# Altium schematic sheet Private_CPU_DDR4.SchDoc
size D
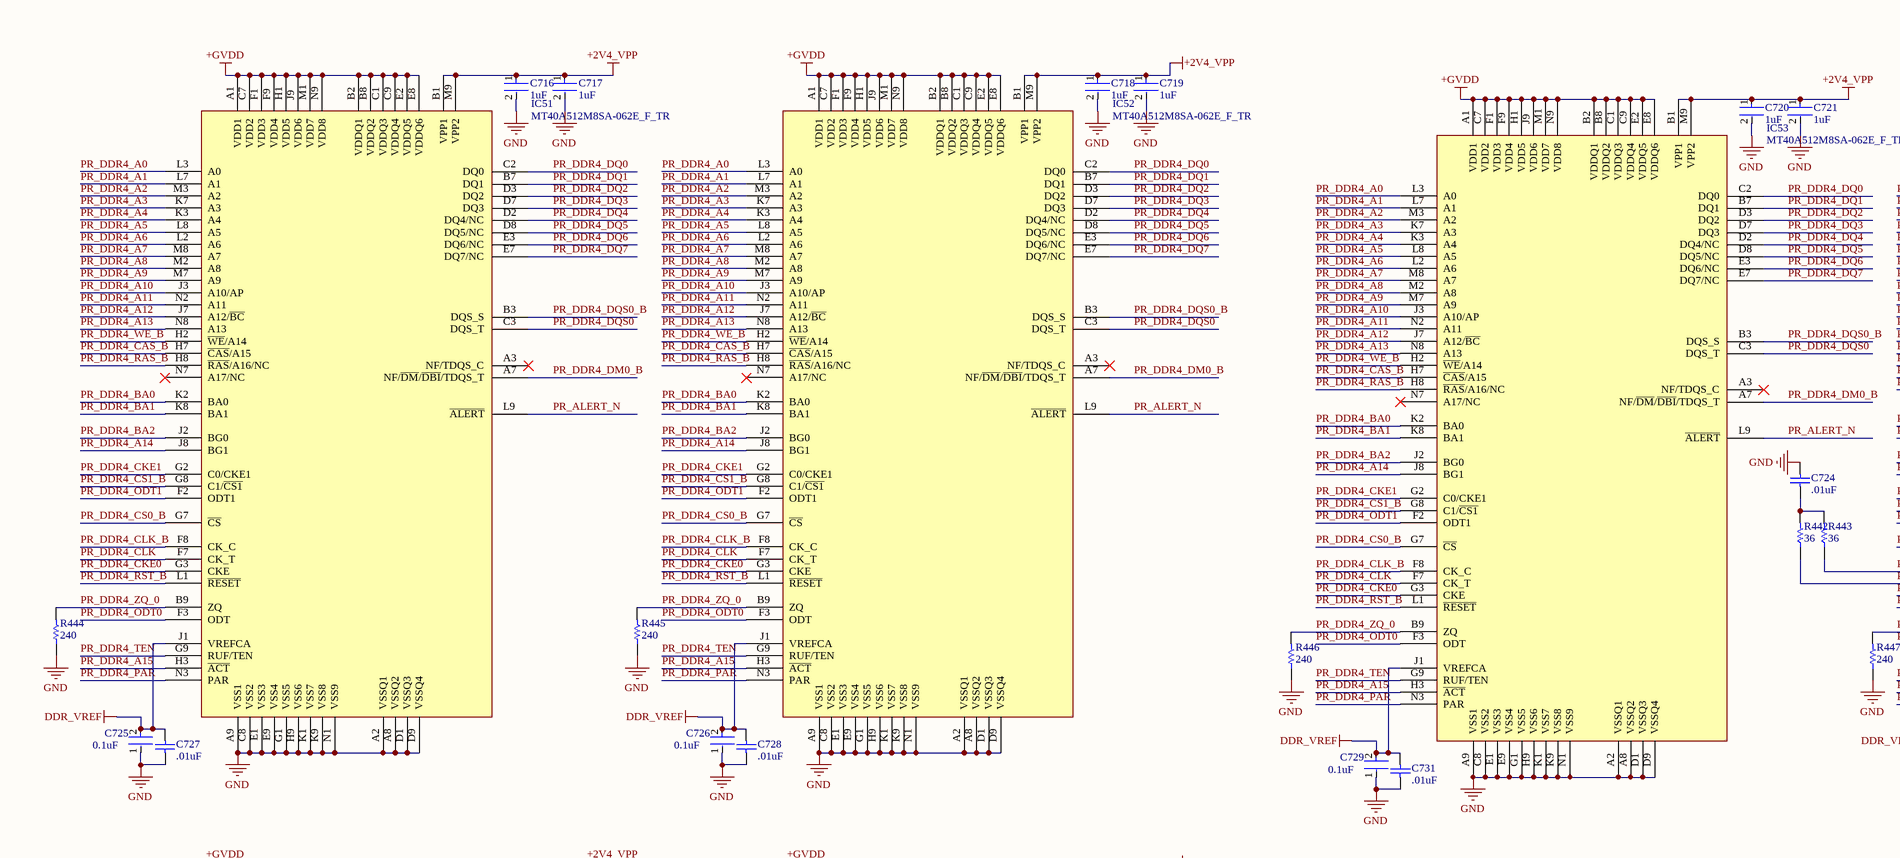
[diagram p0: Private_CPU_DDR4.SchDoc, top left]
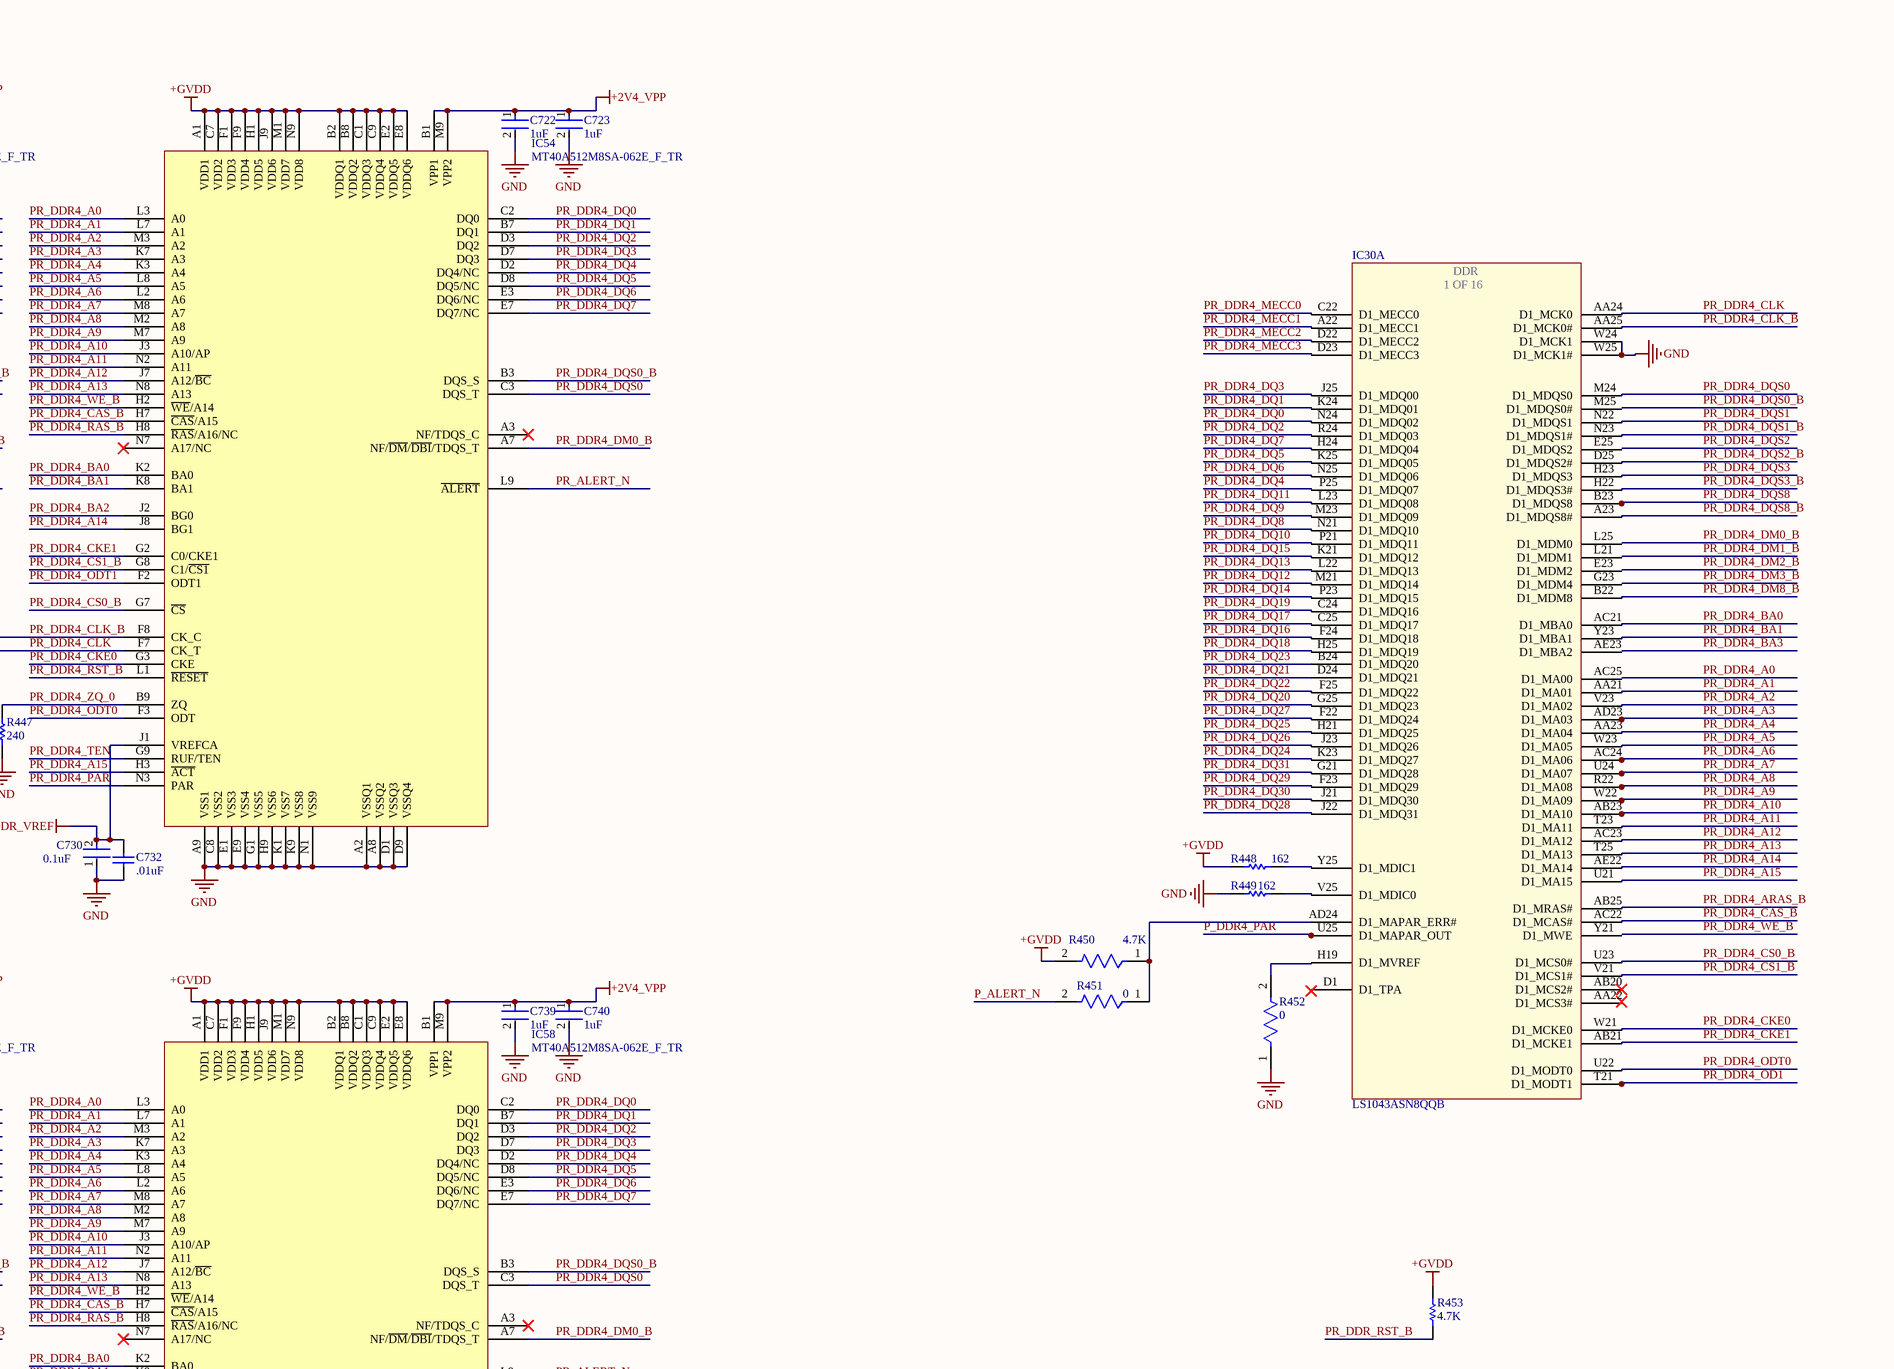
[diagram p1: Private_CPU_DDR4.SchDoc, top right]
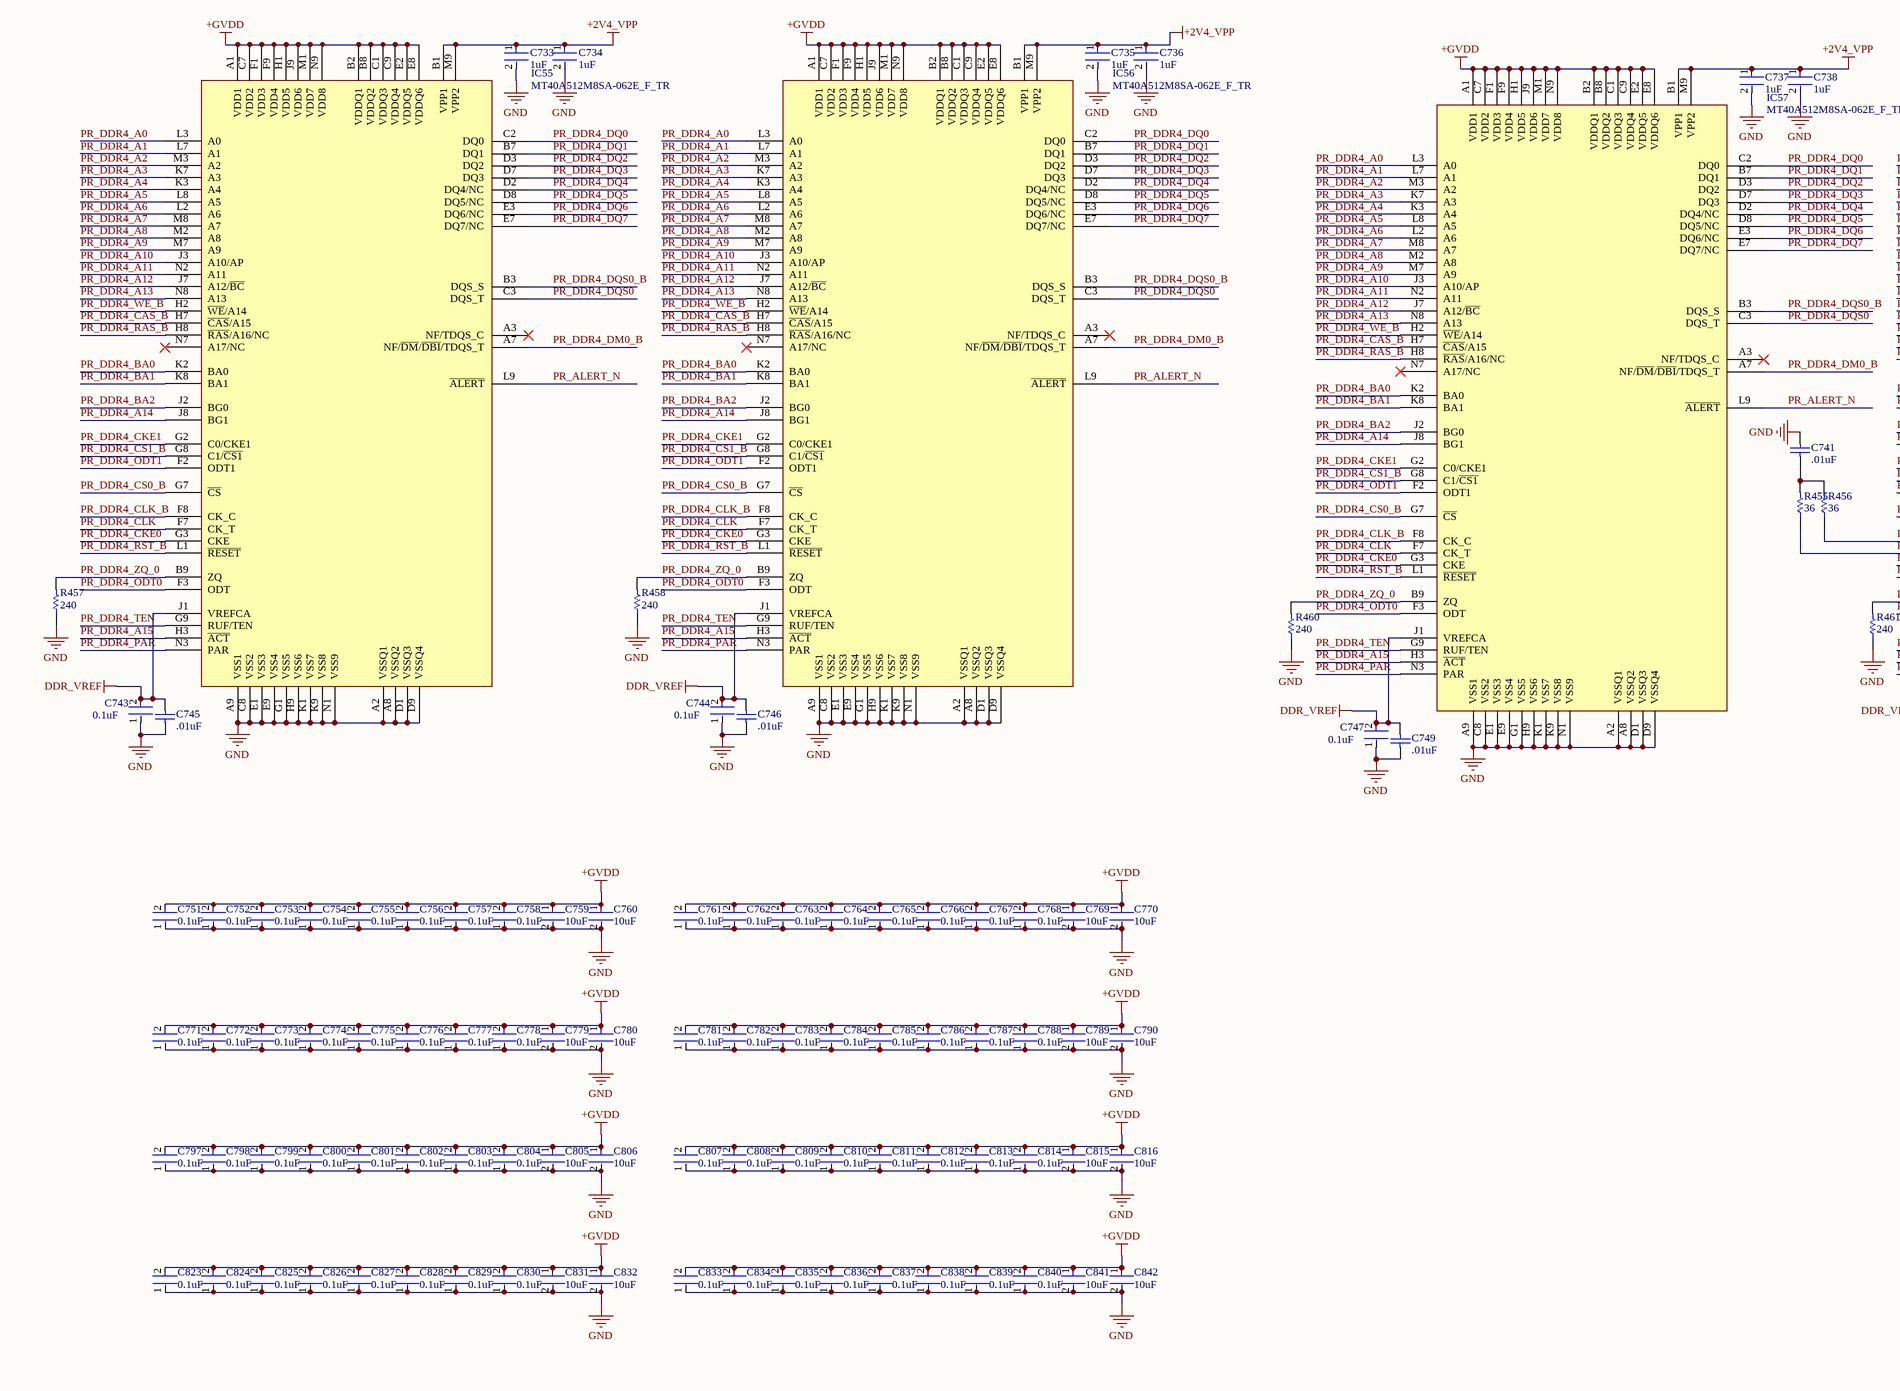
[diagram p2: Private_CPU_DDR4.SchDoc, bottom left]
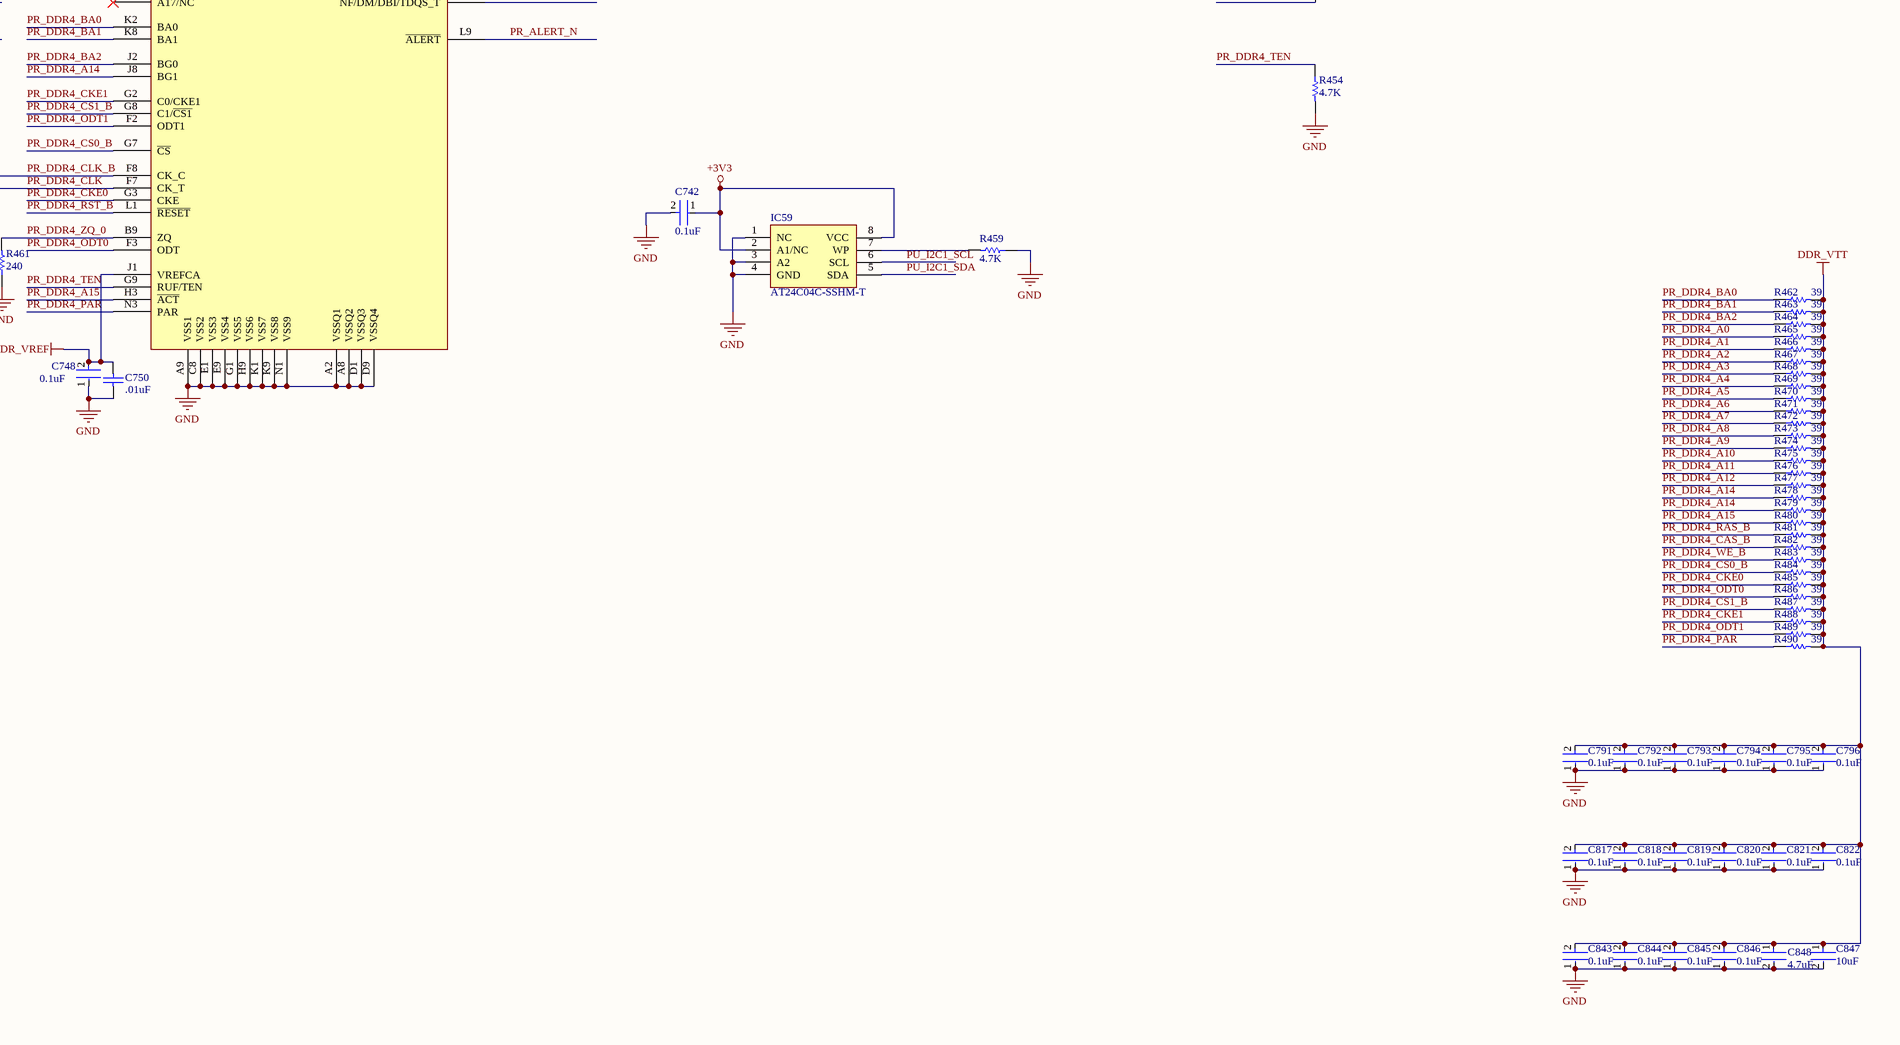
[diagram p3: Private_CPU_DDR4.SchDoc, bottom right]

## Parts
C716  1uF  [FP-GRM15-0_1-MFG]
C717  1uF  [FP-GRM15-0_1-MFG]
C718  1uF  [FP-GRM15-0_1-MFG]
C719  1uF  [FP-GRM15-0_1-MFG]
C720  1uF  [FP-GRM15-0_1-MFG]
C721  1uF  [FP-GRM15-0_1-MFG]
C722  1uF  [FP-GRM15-0_1-MFG]
C723  1uF  [FP-GRM15-0_1-MFG]
C724  .01uF  [CAPC1005X56X25LL10T15]
C725  0.1uF  [FP-GRM15-MFG]
C726  0.1uF  [FP-GRM15-MFG]
C727  .01uF  [CAPC1005X56X25LL10T15]
C728  .01uF  [CAPC1005X56X25LL10T15]
C729  0.1uF  [FP-GRM15-MFG]
C730  0.1uF  [FP-GRM15-MFG]
C731  .01uF  [CAPC1005X56X25LL10T15]
C732  .01uF  [CAPC1005X56X25LL10T15]
C733  1uF  [FP-GRM15-0_1-MFG]
C734  1uF  [FP-GRM15-0_1-MFG]
C735  1uF  [FP-GRM15-0_1-MFG]
C736  1uF  [FP-GRM15-0_1-MFG]
C737  1uF  [FP-GRM15-0_1-MFG]
C738  1uF  [FP-GRM15-0_1-MFG]
C739  1uF  [FP-GRM15-0_1-MFG]
C740  1uF  [FP-GRM15-0_1-MFG]
C741  .01uF  [CAPC1005X56X25LL10T15]
C742  0.1uF  [FP-GRM15-MFG]
C743  0.1uF  [FP-GRM15-MFG]
C744  0.1uF  [FP-GRM15-MFG]
C745  .01uF  [CAPC1005X56X25LL10T15]
C746  .01uF  [CAPC1005X56X25LL10T15]
C747  0.1uF  [FP-GRM15-MFG]
C748  0.1uF  [FP-GRM15-MFG]
C749  .01uF  [CAPC1005X56X25LL10T15]
C750  .01uF  [CAPC1005X56X25LL10T15]
C751  0.1uF  [FP-GRM15-MFG]
C752  0.1uF  [FP-GRM15-MFG]
C753  0.1uF  [FP-GRM15-MFG]
C754  0.1uF  [FP-GRM15-MFG]
C755  0.1uF  [FP-GRM15-MFG]
C756  0.1uF  [FP-GRM15-MFG]
C757  0.1uF  [FP-GRM15-MFG]
C758  0.1uF  [FP-GRM15-MFG]
C759  10uF  [FP-GRM21B-0_1-IPC_C]
C760  10uF  [FP-GRM21B-0_1-IPC_C]
C761  0.1uF  [FP-GRM15-MFG]
C762  0.1uF  [FP-GRM15-MFG]
C763  0.1uF  [FP-GRM15-MFG]
C764  0.1uF  [FP-GRM15-MFG]
C765  0.1uF  [FP-GRM15-MFG]
C766  0.1uF  [FP-GRM15-MFG]
C767  0.1uF  [FP-GRM15-MFG]
C768  0.1uF  [FP-GRM15-MFG]
C769  10uF  [FP-GRM21B-0_1-IPC_C]
C770  10uF  [FP-GRM21B-0_1-IPC_C]
C771  0.1uF  [FP-GRM15-MFG]
C772  0.1uF  [FP-GRM15-MFG]
C773  0.1uF  [FP-GRM15-MFG]
C774  0.1uF  [FP-GRM15-MFG]
C775  0.1uF  [FP-GRM15-MFG]
C776  0.1uF  [FP-GRM15-MFG]
C777  0.1uF  [FP-GRM15-MFG]
C778  0.1uF  [FP-GRM15-MFG]
C779  10uF  [FP-GRM21B-0_1-IPC_C]
C780  10uF  [FP-GRM21B-0_1-IPC_C]
C781  0.1uF  [FP-GRM15-MFG]
C782  0.1uF  [FP-GRM15-MFG]
C783  0.1uF  [FP-GRM15-MFG]
C784  0.1uF  [FP-GRM15-MFG]
C785  0.1uF  [FP-GRM15-MFG]
C786  0.1uF  [FP-GRM15-MFG]
C787  0.1uF  [FP-GRM15-MFG]
C788  0.1uF  [FP-GRM15-MFG]
C789  10uF  [FP-GRM21B-0_1-IPC_C]
C790  10uF  [FP-GRM21B-0_1-IPC_C]
C791  0.1uF  [FP-GRM15-MFG]
C792  0.1uF  [FP-GRM15-MFG]
C793  0.1uF  [FP-GRM15-MFG]
C794  0.1uF  [FP-GRM15-MFG]
C795  0.1uF  [FP-GRM15-MFG]
C796  0.1uF  [FP-GRM15-MFG]
C797  0.1uF  [FP-GRM15-MFG]
C798  0.1uF  [FP-GRM15-MFG]
C799  0.1uF  [FP-GRM15-MFG]
C800  0.1uF  [FP-GRM15-MFG]
C801  0.1uF  [FP-GRM15-MFG]
C802  0.1uF  [FP-GRM15-MFG]
C803  0.1uF  [FP-GRM15-MFG]
C804  0.1uF  [FP-GRM15-MFG]
C805  10uF  [FP-GRM21B-0_1-IPC_C]
C806  10uF  [FP-GRM21B-0_1-IPC_C]
C807  0.1uF  [FP-GRM15-MFG]
C808  0.1uF  [FP-GRM15-MFG]
C809  0.1uF  [FP-GRM15-MFG]
C810  0.1uF  [FP-GRM15-MFG]
C811  0.1uF  [FP-GRM15-MFG]
C812  0.1uF  [FP-GRM15-MFG]
C813  0.1uF  [FP-GRM15-MFG]
C814  0.1uF  [FP-GRM15-MFG]
C815  10uF  [FP-GRM21B-0_1-IPC_C]
C816  10uF  [FP-GRM21B-0_1-IPC_C]
C817  0.1uF  [FP-GRM15-MFG]
C818  0.1uF  [FP-GRM15-MFG]
C819  0.1uF  [FP-GRM15-MFG]
C820  0.1uF  [FP-GRM15-MFG]
C821  0.1uF  [FP-GRM15-MFG]
C822  0.1uF  [FP-GRM15-MFG]
C823  0.1uF  [FP-GRM15-MFG]
C824  0.1uF  [FP-GRM15-MFG]
C825  0.1uF  [FP-GRM15-MFG]
C826  0.1uF  [FP-GRM15-MFG]
C827  0.1uF  [FP-GRM15-MFG]
C828  0.1uF  [FP-GRM15-MFG]
C829  0.1uF  [FP-GRM15-MFG]
C830  0.1uF  [FP-GRM15-MFG]
C831  10uF  [FP-GRM21B-0_1-IPC_C]
C832  10uF  [FP-GRM21B-0_1-IPC_C]
C833  0.1uF  [FP-GRM15-MFG]
C834  0.1uF  [FP-GRM15-MFG]
C835  0.1uF  [FP-GRM15-MFG]
C836  0.1uF  [FP-GRM15-MFG]
C837  0.1uF  [FP-GRM15-MFG]
C838  0.1uF  [FP-GRM15-MFG]
C839  0.1uF  [FP-GRM15-MFG]
C840  0.1uF  [FP-GRM15-MFG]
C841  10uF  [FP-GRM21B-0_1-IPC_C]
C842  10uF  [FP-GRM21B-0_1-IPC_C]
C843  0.1uF  [FP-GRM15-MFG]
C844  0.1uF  [FP-GRM15-MFG]
C845  0.1uF  [FP-GRM15-MFG]
C846  0.1uF  [FP-GRM15-MFG]
C847  10uF  [FP-GRM21B-0_1-IPC_C]
C848  4.7uF  [FP-GRM155-0_1-IPC_B]
IC30  LS1043ASN8QQB  [BGA780C80P28X28_2300X2300X261]  (part A of 16)
IC51  MT40A512M8SA-062E_F_TR  [BGA78C80P9X13_750X1100X120]
IC52  MT40A512M8SA-062E_F_TR  [BGA78C80P9X13_750X1100X120]
IC53  MT40A512M8SA-062E_F_TR  [BGA78C80P9X13_750X1100X120]
IC54  MT40A512M8SA-062E_F_TR  [BGA78C80P9X13_750X1100X120]
IC55  MT40A512M8SA-062E_F_TR  [BGA78C80P9X13_750X1100X120]
IC56  MT40A512M8SA-062E_F_TR  [BGA78C80P9X13_750X1100X120]
IC57  MT40A512M8SA-062E_F_TR  [BGA78C80P9X13_750X1100X120]
IC58  MT40A512M8SA-062E_F_TR  [BGA78C80P9X13_750X1100X120]
IC59  AT24C04C-SSHM-T  [SOIC127P600X175-8N]
R442  36  [RESC1005X40X25ML05T05]
R443  36  [RESC1005X40X25ML05T05]
R444  240  [RESC1005X40X25ML05T05]
R445  240  [RESC1005X40X25ML05T05]
R446  240  [RESC1005X40X25ML05T05]
R447  240  [RESC1005X40X25ML05T05]
R448  162  [RESC1005X40X25LL05T05]
R449  162  [RESC1005X40X25LL05T05]
R450  4.7K  [FP-CRCW0402-e3-IPC_B]
R451  0  [FP-CRCW0402-e3-IPC_C]
R452  0  [FP-CRCW0402-e3-IPC_C]
R453  4.7K  [RESC1005X40X25LL05T05]
R454  4.7K  [RESC1005X40X25LL05T05]
R455  36  [RESC1005X40X25ML05T05]
R456  36  [RESC1005X40X25ML05T05]
R457  240  [RESC1005X40X25ML05T05]
R458  240  [RESC1005X40X25ML05T05]
R459  4.7K  [RESC1005X40X25LL05T05]
R460  240  [RESC1005X40X25ML05T05]
R461  240  [RESC1005X40X25ML05T05]
R462  39  [RESC1005X40X25LL05T05]
R463  39  [RESC1005X40X25LL05T05]
R464  39  [RESC1005X40X25LL05T05]
R465  39  [RESC1005X40X25LL05T05]
R466  39  [RESC1005X40X25LL05T05]
R467  39  [RESC1005X40X25LL05T05]
R468  39  [RESC1005X40X25LL05T05]
R469  39  [RESC1005X40X25LL05T05]
R470  39  [RESC1005X40X25LL05T05]
R471  39  [RESC1005X40X25LL05T05]
R472  39  [RESC1005X40X25LL05T05]
R473  39  [RESC1005X40X25LL05T05]
R474  39  [RESC1005X40X25LL05T05]
R475  39  [RESC1005X40X25LL05T05]
R476  39  [RESC1005X40X25LL05T05]
R477  39  [RESC1005X40X25LL05T05]
R478  39  [RESC1005X40X25LL05T05]
R479  39  [RESC1005X40X25LL05T05]
R480  39  [RESC1005X40X25LL05T05]
R481  39  [RESC1005X40X25LL05T05]
R482  39  [RESC1005X40X25LL05T05]
R483  39  [RESC1005X40X25LL05T05]
R484  39  [RESC1005X40X25LL05T05]
R485  39  [RESC1005X40X25LL05T05]
R486  39  [RESC1005X40X25LL05T05]
R487  39  [RESC1005X40X25LL05T05]
R488  39  [RESC1005X40X25LL05T05]
R489  39  [RESC1005X40X25LL05T05]
R490  39  [RESC1005X40X25LL05T05]

## Nets
+2V4_VPP: C716.1 C717.1 C718.1 C719.1 C720.1 C721.1 C722.1 C723.1 C733.1 C734.1 C735.1 C736.1 C737.1 C738.1 C739.1 C740.1 IC51.B1(VPP1) IC51.M9(VPP2) IC52.B1(VPP1) IC52.M9(VPP2) IC53.B1(VPP1) IC53.M9(VPP2) IC54.B1(VPP1) IC54.M9(VPP2) IC55.B1(VPP1) IC55.M9(VPP2) IC56.B1(VPP1) IC56.M9(VPP2) IC57.B1(VPP1) IC57.M9(VPP2) IC58.B1(VPP1) IC58.M9(VPP2)
+3V3: C742.1 IC59.2(A1/NC) IC59.8(VCC)
+GVDD: C751.2 C752.2 C753.2 C754.2 C755.2 C756.2 C757.2 C758.2 C759.1 C760.1 C761.2 C762.2 C763.2 C764.2 C765.2 C766.2 C767.2 C768.2 C769.1 C770.1 C771.2 C772.2 C773.2 C774.2 C775.2 C776.2 C777.2 C778.2 C779.1 C780.1 C781.2 C782.2 C783.2 C784.2 C785.2 C786.2 C787.2 C788.2 C789.1 C790.1 C797.2 C798.2 C799.2 C800.2 C801.2 C802.2 C803.2 C804.2 C805.1 C806.1 C807.2 C808.2 C809.2 C810.2 C811.2 C812.2 C813.2 C814.2 C815.1 C816.1 C823.2 C824.2 C825.2 C826.2 C827.2 C828.2 C829.2 C830.2 C831.1 C832.1 C833.2 C834.2 C835.2 C836.2 C837.2 C838.2 C839.2 C840.2 C841.1 C842.1 IC51.A1(VDD1) IC51.B2(VDDQ1) IC51.B8(VDDQ2) IC51.C1(VDDQ3) IC51.C7(VDD2) IC51.C9(VDDQ4) IC51.E2(VDDQ5) IC51.E8(VDDQ6) IC51.F1(VDD3) IC51.F9(VDD4) IC51.H1(VDD5) IC51.J9(VDD6) IC51.M1(VDD7) IC51.N9(VDD8) IC52.A1(VDD1) IC52.B2(VDDQ1) IC52.B8(VDDQ2) IC52.C1(VDDQ3) IC52.C7(VDD2) IC52.C9(VDDQ4) IC52.E2(VDDQ5) IC52.E8(VDDQ6) IC52.F1(VDD3) IC52.F9(VDD4) IC52.H1(VDD5) IC52.J9(VDD6) IC52.M1(VDD7) IC52.N9(VDD8) IC53.A1(VDD1) IC53.B2(VDDQ1) IC53.B8(VDDQ2) IC53.C1(VDDQ3) IC53.C7(VDD2) IC53.C9(VDDQ4) IC53.E2(VDDQ5) IC53.E8(VDDQ6) IC53.F1(VDD3) IC53.F9(VDD4) IC53.H1(VDD5) IC53.J9(VDD6) IC53.M1(VDD7) IC53.N9(VDD8) IC54.A1(VDD1) IC54.B2(VDDQ1) IC54.B8(VDDQ2) IC54.C1(VDDQ3) IC54.C7(VDD2) IC54.C9(VDDQ4) IC54.E2(VDDQ5) IC54.E8(VDDQ6) IC54.F1(VDD3) IC54.F9(VDD4) IC54.H1(VDD5) IC54.J9(VDD6) IC54.M1(VDD7) IC54.N9(VDD8) IC55.A1(VDD1) IC55.B2(VDDQ1) IC55.B8(VDDQ2) IC55.C1(VDDQ3) IC55.C7(VDD2) IC55.C9(VDDQ4) IC55.E2(VDDQ5) IC55.E8(VDDQ6) IC55.F1(VDD3) IC55.F9(VDD4) IC55.H1(VDD5) IC55.J9(VDD6) IC55.M1(VDD7) IC55.N9(VDD8) IC56.A1(VDD1) IC56.B2(VDDQ1) IC56.B8(VDDQ2) IC56.C1(VDDQ3) IC56.C7(VDD2) IC56.C9(VDDQ4) IC56.E2(VDDQ5) IC56.E8(VDDQ6) IC56.F1(VDD3) IC56.F9(VDD4) IC56.H1(VDD5) IC56.J9(VDD6) IC56.M1(VDD7) IC56.N9(VDD8) IC57.A1(VDD1) IC57.B2(VDDQ1) IC57.B8(VDDQ2) IC57.C1(VDDQ3) IC57.C7(VDD2) IC57.C9(VDDQ4) IC57.E2(VDDQ5) IC57.E8(VDDQ6) IC57.F1(VDD3) IC57.F9(VDD4) IC57.H1(VDD5) IC57.J9(VDD6) IC57.M1(VDD7) IC57.N9(VDD8) IC58.A1(VDD1) IC58.B2(VDDQ1) IC58.B8(VDDQ2) IC58.C1(VDDQ3) IC58.C7(VDD2) IC58.C9(VDDQ4) IC58.E2(VDDQ5) IC58.E8(VDDQ6) IC58.F1(VDD3) IC58.F9(VDD4) IC58.H1(VDD5) IC58.J9(VDD6) IC58.M1(VDD7) IC58.N9(VDD8) R448.1 R450.2 R453.1
DDR_VREF: C725.2 C726.2 C727.2 C728.2 C729.2 C730.2 C731.2 C732.2 C743.2 C744.2 C745.2 C746.2 C747.2 C748.2 C749.2 C750.2 IC51.J1(VREFCA) IC52.J1(VREFCA) IC53.J1(VREFCA) IC54.J1(VREFCA) IC55.J1(VREFCA) IC56.J1(VREFCA) IC57.J1(VREFCA) IC58.J1(VREFCA)
DDR_VTT: C791.2 C792.2 C793.2 C794.2 C795.2 C796.2 C817.2 C818.2 C819.2 C820.2 C821.2 C822.2 C843.2 C844.2 C845.2 C846.2 C847.1 C848.1 R462.2 R463.2 R464.2 R465.2 R466.2 R467.2 R468.2 R469.2 R470.2 R471.2 R472.2 R473.2 R474.2 R475.2 R476.2 R477.2 R478.2 R479.2 R480.2 R481.2 R482.2 R483.2 R484.2 R485.2 R486.2 R487.2 R488.2 R489.2 R490.2
GND: C716.2 C717.2 C718.2 C719.2 C720.2 C721.2 C722.2 C723.2 C724.2 C725.1 C726.1 C727.1 C728.1 C729.1 C730.1 C731.1 C732.1 C733.2 C734.2 C735.2 C736.2 C737.2 C738.2 C739.2 C740.2 C741.2 C742.2 C743.1 C744.1 C745.1 C746.1 C747.1 C748.1 C749.1 C750.1 C751.1 C752.1 C753.1 C754.1 C755.1 C756.1 C757.1 C758.1 C759.2 C760.2 C761.1 C762.1 C763.1 C764.1 C765.1 C766.1 C767.1 C768.1 C769.2 C770.2 C771.1 C772.1 C773.1 C774.1 C775.1 C776.1 C777.1 C778.1 C779.2 C780.2 C781.1 C782.1 C783.1 C784.1 C785.1 C786.1 C787.1 C788.1 C789.2 C790.2 C791.1 C792.1 C793.1 C794.1 C795.1 C796.1 C797.1 C798.1 C799.1 C800.1 C801.1 C802.1 C803.1 C804.1 C805.2 C806.2 C807.1 C808.1 C809.1 C810.1 C811.1 C812.1 C813.1 C814.1 C815.2 C816.2 C817.1 C818.1 C819.1 C820.1 C821.1 C822.1 C823.1 C824.1 C825.1 C826.1 C827.1 C828.1 C829.1 C830.1 C831.2 C832.2 C833.1 C834.1 C835.1 C836.1 C837.1 C838.1 C839.1 C840.1 C841.2 C842.2 C843.1 C844.1 C845.1 C846.1 C847.2 C848.2 IC30.W24(D1_MCK1) IC30.W25(D1_MCK1#) IC51.A2(VSSQ1) IC51.A8(VSSQ2) IC51.A9(VSS1) IC51.C8(VSS2) IC51.D1(VSSQ3) IC51.D9(VSSQ4) IC51.E1(VSS3) IC51.E9(VSS4) IC51.G1(VSS5) IC51.H9(VSS6) IC51.K1(VSS7) IC51.K9(VSS8) IC51.N1(VSS9) IC52.A2(VSSQ1) IC52.A8(VSSQ2) IC52.A9(VSS1) IC52.C8(VSS2) IC52.D1(VSSQ3) IC52.D9(VSSQ4) IC52.E1(VSS3) IC52.E9(VSS4) IC52.G1(VSS5) IC52.H9(VSS6) IC52.K1(VSS7) IC52.K9(VSS8) IC52.N1(VSS9) IC53.A2(VSSQ1) IC53.A8(VSSQ2) IC53.A9(VSS1) IC53.C8(VSS2) IC53.D1(VSSQ3) IC53.D9(VSSQ4) IC53.E1(VSS3) IC53.E9(VSS4) IC53.G1(VSS5) IC53.H9(VSS6) IC53.K1(VSS7) IC53.K9(VSS8) IC53.N1(VSS9) IC54.A2(VSSQ1) IC54.A8(VSSQ2) IC54.A9(VSS1) IC54.C8(VSS2) IC54.D1(VSSQ3) IC54.D9(VSSQ4) IC54.E1(VSS3) IC54.E9(VSS4) IC54.G1(VSS5) IC54.H9(VSS6) IC54.K1(VSS7) IC54.K9(VSS8) IC54.N1(VSS9) IC55.A2(VSSQ1) IC55.A8(VSSQ2) IC55.A9(VSS1) IC55.C8(VSS2) IC55.D1(VSSQ3) IC55.D9(VSSQ4) IC55.E1(VSS3) IC55.E9(VSS4) IC55.G1(VSS5) IC55.H9(VSS6) IC55.K1(VSS7) IC55.K9(VSS8) IC55.N1(VSS9) IC56.A2(VSSQ1) IC56.A8(VSSQ2) IC56.A9(VSS1) IC56.C8(VSS2) IC56.D1(VSSQ3) IC56.D9(VSSQ4) IC56.E1(VSS3) IC56.E9(VSS4) IC56.G1(VSS5) IC56.H9(VSS6) IC56.K1(VSS7) IC56.K9(VSS8) IC56.N1(VSS9) IC57.A2(VSSQ1) IC57.A8(VSSQ2) IC57.A9(VSS1) IC57.C8(VSS2) IC57.D1(VSSQ3) IC57.D9(VSSQ4) IC57.E1(VSS3) IC57.E9(VSS4) IC57.G1(VSS5) IC57.H9(VSS6) IC57.K1(VSS7) IC57.K9(VSS8) IC57.N1(VSS9) IC58.A2(VSSQ1) IC58.A8(VSSQ2) IC58.A9(VSS1) IC58.C8(VSS2) IC58.D1(VSSQ3) IC58.D9(VSSQ4) IC58.E1(VSS3) IC58.E9(VSS4) IC58.G1(VSS5) IC58.H9(VSS6) IC58.K1(VSS7) IC58.K9(VSS8) IC58.N1(VSS9) IC59.1(NC) IC59.3(A2) IC59.4(GND) R444.1 R445.1 R446.1 R447.1 R449.1 R452.1 R454.2 R457.1 R458.1 R459.1 R460.1 R461.1
P_ALERT_N: R451.2
P_DDR4_PAR: IC30.U25(D1_MAPAR_OUT)
PR_ALERT_N: IC51.L9(~{ALERT}) IC52.L9(~{ALERT}) IC53.L9(~{ALERT}) IC54.L9(~{ALERT}) IC55.L9(~{ALERT}) IC56.L9(~{ALERT}) IC57.L9(~{ALERT}) IC58.L9(~{ALERT})
PR_DDR4_A0: IC51.L3(A0) IC52.L3(A0) IC53.L3(A0) IC54.L3(A0) IC55.L3(A0) IC56.L3(A0) IC57.L3(A0) IC58.L3(A0) R465.1
PR_DDR4_A1: IC30.AA21(D1_MA01) IC51.L7(A1) IC52.L7(A1) IC53.L7(A1) IC54.L7(A1) IC55.L7(A1) IC56.L7(A1) IC57.L7(A1) IC58.L7(A1) R466.1
PR_DDR4_A2: IC30.V23(D1_MA02) IC51.M3(A2) IC52.M3(A2) IC53.M3(A2) IC54.M3(A2) IC55.M3(A2) IC56.M3(A2) IC57.M3(A2) IC58.M3(A2) R467.1
PR_DDR4_A3: IC30.AD23(D1_MA03) IC51.K7(A3) IC52.K7(A3) IC53.K7(A3) IC54.K7(A3) IC55.K7(A3) IC56.K7(A3) IC57.K7(A3) IC58.K7(A3) R468.1
PR_DDR4_A4: IC30.AA23(D1_MA04) IC51.K3(A4) IC52.K3(A4) IC53.K3(A4) IC54.K3(A4) IC55.K3(A4) IC56.K3(A4) IC57.K3(A4) IC58.K3(A4) R469.1
PR_DDR4_A5: IC30.W23(D1_MA05) IC51.L8(A5) IC52.L8(A5) IC53.L8(A5) IC54.L8(A5) IC55.L8(A5) IC56.L8(A5) IC57.L8(A5) IC58.L8(A5) R470.1
PR_DDR4_A6: IC30.AC24(D1_MA06) IC51.L2(A6) IC52.L2(A6) IC53.L2(A6) IC54.L2(A6) IC55.L2(A6) IC56.L2(A6) IC57.L2(A6) IC58.L2(A6) R471.1
PR_DDR4_A7: IC30.U24(D1_MA07) IC51.M8(A7) IC52.M8(A7) IC53.M8(A7) IC54.M8(A7) IC55.M8(A7) IC56.M8(A7) IC57.M8(A7) IC58.M8(A7) R472.1
PR_DDR4_A8: IC30.R22(D1_MA08) IC51.M2(A8) IC52.M2(A8) IC53.M2(A8) IC54.M2(A8) IC55.M2(A8) IC56.M2(A8) IC57.M2(A8) IC58.M2(A8) R473.1
PR_DDR4_A9: IC30.W22(D1_MA09) IC51.M7(A9) IC52.M7(A9) IC53.M7(A9) IC54.M7(A9) IC55.M7(A9) IC56.M7(A9) IC57.M7(A9) IC58.M7(A9) R474.1
PR_DDR4_A10: IC30.AB23(D1_MA10) IC51.J3(A10/AP) IC52.J3(A10/AP) IC53.J3(A10/AP) IC54.J3(A10/AP) IC55.J3(A10/AP) IC56.J3(A10/AP) IC57.J3(A10/AP) IC58.J3(A10/AP) R475.1
PR_DDR4_A11: IC30.T23(D1_MA11) IC51.N2(A11) IC52.N2(A11) IC53.N2(A11) IC54.N2(A11) IC55.N2(A11) IC56.N2(A11) IC57.N2(A11) IC58.N2(A11) R476.1
PR_DDR4_A12: IC30.AC23(D1_MA12) IC51.J7(A12/~{BC}) IC52.J7(A12/~{BC}) IC53.J7(A12/~{BC}) IC54.J7(A12/~{BC}) IC55.J7(A12/~{BC}) IC56.J7(A12/~{BC}) IC57.J7(A12/~{BC}) IC58.J7(A12/~{BC}) R477.1
PR_DDR4_A13: IC30.T25(D1_MA13) IC51.N8(A13) IC52.N8(A13) IC53.N8(A13) IC54.N8(A13) IC55.N8(A13) IC56.N8(A13) IC57.N8(A13) IC58.N8(A13)
PR_DDR4_A14: IC30.AE22(D1_MA14) IC51.J8(BG1) IC52.J8(BG1) IC53.J8(BG1) IC54.J8(BG1) IC55.J8(BG1) IC56.J8(BG1) IC57.J8(BG1) IC58.J8(BG1) R478.1 R479.1
PR_DDR4_A15: IC30.U21(D1_MA15) IC51.H3(~{ACT}) IC52.H3(~{ACT}) IC53.H3(~{ACT}) IC54.H3(~{ACT}) IC55.H3(~{ACT}) IC56.H3(~{ACT}) IC57.H3(~{ACT}) IC58.H3(~{ACT}) R480.1
PR_DDR4_ARAS_B: IC30.AB25(D1_MRAS#)
PR_DDR4_BA0: IC30.AC21(D1_MBA0) IC51.K2(BA0) IC52.K2(BA0) IC53.K2(BA0) IC54.K2(BA0) IC55.K2(BA0) IC56.K2(BA0) IC57.K2(BA0) IC58.K2(BA0) R462.1
PR_DDR4_BA1: IC30.Y23(D1_MBA1) IC51.K8(BA1) IC52.K8(BA1) IC53.K8(BA1) IC54.K8(BA1) IC55.K8(BA1) IC56.K8(BA1) IC57.K8(BA1) IC58.K8(BA1) R463.1
PR_DDR4_BA2: IC51.J2(BG0) IC52.J2(BG0) IC53.J2(BG0) IC54.J2(BG0) IC55.J2(BG0) IC56.J2(BG0) IC57.J2(BG0) IC58.J2(BG0) R464.1
PR_DDR4_CAS_B: IC30.AC22(D1_MCAS#) IC51.H7(~{CAS}/A15) IC52.H7(~{CAS}/A15) IC53.H7(~{CAS}/A15) IC54.H7(~{CAS}/A15) IC55.H7(~{CAS}/A15) IC56.H7(~{CAS}/A15) IC57.H7(~{CAS}/A15) IC58.H7(~{CAS}/A15) R482.1
PR_DDR4_CKE0: IC30.W21(D1_MCKE0) IC51.G3(CKE) IC52.G3(CKE) IC53.G3(CKE) IC54.G3(CKE) IC55.G3(CKE) IC56.G3(CKE) IC57.G3(CKE) IC58.G3(CKE) R485.1
PR_DDR4_CKE1: IC30.AB21(D1_MCKE1) IC51.G2(C0/CKE1) IC52.G2(C0/CKE1) IC53.G2(C0/CKE1) IC54.G2(C0/CKE1) IC55.G2(C0/CKE1) IC56.G2(C0/CKE1) IC57.G2(C0/CKE1) IC58.G2(C0/CKE1) R488.1
PR_DDR4_CLK: IC30.AA24(D1_MCK0) IC51.F7(CK_T) IC52.F7(CK_T) IC53.F7(CK_T) IC54.F7(CK_T) IC55.F7(CK_T) IC56.F7(CK_T) IC57.F7(CK_T) IC58.F7(CK_T) R442.1 R455.1
PR_DDR4_CLK_B: IC30.AA25(D1_MCK0#) IC51.F8(CK_C) IC52.F8(CK_C) IC53.F8(CK_C) IC54.F8(CK_C) IC55.F8(CK_C) IC56.F8(CK_C) IC57.F8(CK_C) IC58.F8(CK_C) R443.1 R456.1
PR_DDR4_CS0_B: IC30.U23(D1_MCS0#) IC51.G7(~{CS}) IC52.G7(~{CS}) IC53.G7(~{CS}) IC54.G7(~{CS}) IC55.G7(~{CS}) IC56.G7(~{CS}) IC57.G7(~{CS}) IC58.G7(~{CS}) R484.1
PR_DDR4_CS1_B: IC30.V21(D1_MCS1#) IC51.G8(C1/~{CS1}) IC52.G8(C1/~{CS1}) IC53.G8(C1/~{CS1}) IC54.G8(C1/~{CS1}) IC55.G8(C1/~{CS1}) IC56.G8(C1/~{CS1}) IC57.G8(C1/~{CS1}) IC58.G8(C1/~{CS1}) R487.1
PR_DDR4_DM0_B: IC51.A7(NF/~{DM}/~{DBI}/TDQS_T) IC52.A7(NF/~{DM}/~{DBI}/TDQS_T) IC53.A7(NF/~{DM}/~{DBI}/TDQS_T) IC54.A7(NF/~{DM}/~{DBI}/TDQS_T) IC55.A7(NF/~{DM}/~{DBI}/TDQS_T) IC56.A7(NF/~{DM}/~{DBI}/TDQS_T) IC57.A7(NF/~{DM}/~{DBI}/TDQS_T) IC58.A7(NF/~{DM}/~{DBI}/TDQS_T)
PR_DDR4_DM8_B: IC30.B22(D1_MDM8)
PR_DDR4_DQ0: IC30.N24(D1_MDQ02) IC51.C2(DQ0) IC52.C2(DQ0) IC53.C2(DQ0) IC54.C2(DQ0) IC55.C2(DQ0) IC56.C2(DQ0) IC57.C2(DQ0) IC58.C2(DQ0)
PR_DDR4_DQ1: IC30.K24(D1_MDQ01) IC51.B7(DQ1) IC52.B7(DQ1) IC53.B7(DQ1) IC54.B7(DQ1) IC55.B7(DQ1) IC56.B7(DQ1) IC57.B7(DQ1) IC58.B7(DQ1)
PR_DDR4_DQ2: IC30.R24(D1_MDQ03) IC51.D3(DQ2) IC52.D3(DQ2) IC53.D3(DQ2) IC54.D3(DQ2) IC55.D3(DQ2) IC56.D3(DQ2) IC57.D3(DQ2) IC58.D3(DQ2)
PR_DDR4_DQ3: IC30.J25(D1_MDQ00) IC51.D7(DQ3) IC52.D7(DQ3) IC53.D7(DQ3) IC54.D7(DQ3) IC55.D7(DQ3) IC56.D7(DQ3) IC57.D7(DQ3) IC58.D7(DQ3)
PR_DDR4_DQ4: IC30.P25(D1_MDQ07) IC51.D2(DQ4/NC) IC52.D2(DQ4/NC) IC53.D2(DQ4/NC) IC54.D2(DQ4/NC) IC55.D2(DQ4/NC) IC56.D2(DQ4/NC) IC57.D2(DQ4/NC) IC58.D2(DQ4/NC)
PR_DDR4_DQ5: IC30.K25(D1_MDQ05) IC51.D8(DQ5/NC) IC52.D8(DQ5/NC) IC53.D8(DQ5/NC) IC54.D8(DQ5/NC) IC55.D8(DQ5/NC) IC56.D8(DQ5/NC) IC57.D8(DQ5/NC) IC58.D8(DQ5/NC)
PR_DDR4_DQ6: IC30.N25(D1_MDQ06) IC51.E3(DQ6/NC) IC52.E3(DQ6/NC) IC53.E3(DQ6/NC) IC54.E3(DQ6/NC) IC55.E3(DQ6/NC) IC56.E3(DQ6/NC) IC57.E3(DQ6/NC) IC58.E3(DQ6/NC)
PR_DDR4_DQ7: IC30.H24(D1_MDQ04) IC51.E7(DQ7/NC) IC52.E7(DQ7/NC) IC53.E7(DQ7/NC) IC54.E7(DQ7/NC) IC55.E7(DQ7/NC) IC56.E7(DQ7/NC) IC57.E7(DQ7/NC) IC58.E7(DQ7/NC)
PR_DDR4_DQ8: IC30.N21(D1_MDQ10)
PR_DDR4_DQ9: IC30.M23(D1_MDQ09)
PR_DDR4_DQ10: IC30.P21(D1_MDQ11)
PR_DDR4_DQ11: IC30.L23(D1_MDQ08)
PR_DDR4_DQ12: IC30.M21(D1_MDQ14)
PR_DDR4_DQ13: IC30.L22(D1_MDQ13)
PR_DDR4_DQ14: IC30.P23(D1_MDQ15)
PR_DDR4_DQ15: IC30.K21(D1_MDQ12)
PR_DDR4_DQ16: IC30.F24(D1_MDQ18)
PR_DDR4_DQ17: IC30.C25(D1_MDQ17)
PR_DDR4_DQ18: IC30.H25(D1_MDQ19)
PR_DDR4_DQ19: IC30.C24(D1_MDQ16)
PR_DDR4_DQ20: IC30.G25(D1_MDQ23)
PR_DDR4_DQ21: IC30.D24(D1_MDQ21)
PR_DDR4_DQ22: IC30.F25(D1_MDQ22)
PR_DDR4_DQ23: IC30.B24(D1_MDQ20)
PR_DDR4_DQ24: IC30.K23(D1_MDQ27)
PR_DDR4_DQ25: IC30.H21(D1_MDQ25)
PR_DDR4_DQ26: IC30.J23(D1_MDQ26)
PR_DDR4_DQ27: IC30.F22(D1_MDQ24)
PR_DDR4_DQ28: IC30.J22(D1_MDQ31)
PR_DDR4_DQ29: IC30.F23(D1_MDQ29)
PR_DDR4_DQ30: IC30.J21(D1_MDQ30)
PR_DDR4_DQ31: IC30.G21(D1_MDQ28)
PR_DDR4_DQS0: IC30.M24(D1_MDQS0) IC51.C3(DQS_T) IC52.C3(DQS_T) IC53.C3(DQS_T) IC54.C3(DQS_T) IC55.C3(DQS_T) IC56.C3(DQS_T) IC57.C3(DQS_T) IC58.C3(DQS_T)
PR_DDR4_DQS0_B: IC51.B3(DQS_S) IC52.B3(DQS_S) IC53.B3(DQS_S) IC54.B3(DQS_S) IC55.B3(DQS_S) IC56.B3(DQS_S) IC57.B3(DQS_S) IC58.B3(DQS_S)
PR_DDR4_DQS1: IC30.N22(D1_MDQS1)
PR_DDR4_DQS1_B: IC30.N23(D1_MDQS1#)
PR_DDR4_DQS2_B: IC30.D25(D1_MDQS2#)
PR_DDR4_DQS3: IC30.H23(D1_MDQS3)
PR_DDR4_DQS3_B: IC30.H22(D1_MDQS3#)
PR_DDR4_DQS8: IC30.B23(D1_MDQS8)
PR_DDR4_DQS8_B: IC30.A23(D1_MDQS8#)
PR_DDR4_MECC0: IC30.C22(D1_MECC0)
PR_DDR4_MECC1: IC30.A22(D1_MECC1)
PR_DDR4_MECC2: IC30.D22(D1_MECC2)
PR_DDR4_MECC3: IC30.D23(D1_MECC3)
PR_DDR4_OD1: IC30.T21(D1_MODT1)
PR_DDR4_ODT0: IC30.U22(D1_MODT0) IC51.F3(ODT) IC52.F3(ODT) IC53.F3(ODT) IC54.F3(ODT) IC55.F3(ODT) IC56.F3(ODT) IC57.F3(ODT) IC58.F3(ODT) R486.1
PR_DDR4_ODT1: IC51.F2(ODT1) IC52.F2(ODT1) IC53.F2(ODT1) IC54.F2(ODT1) IC55.F2(ODT1) IC56.F2(ODT1) IC57.F2(ODT1) IC58.F2(ODT1) R489.1
PR_DDR4_PAR: IC51.N3(PAR) IC52.N3(PAR) IC53.N3(PAR) IC54.N3(PAR) IC55.N3(PAR) IC56.N3(PAR) IC57.N3(PAR) IC58.N3(PAR) R490.1
PR_DDR4_RAS_B: IC51.H8(~{RAS}/A16/NC) IC52.H8(~{RAS}/A16/NC) IC53.H8(~{RAS}/A16/NC) IC54.H8(~{RAS}/A16/NC) IC55.H8(~{RAS}/A16/NC) IC56.H8(~{RAS}/A16/NC) IC57.H8(~{RAS}/A16/NC) IC58.H8(~{RAS}/A16/NC) R481.1
PR_DDR4_RST_B: IC51.L1(~{RESET}) IC52.L1(~{RESET}) IC53.L1(~{RESET}) IC54.L1(~{RESET}) IC55.L1(~{RESET}) IC56.L1(~{RESET}) IC57.L1(~{RESET}) IC58.L1(~{RESET})
PR_DDR4_TEN: IC51.G9(RUF/TEN) IC52.G9(RUF/TEN) IC53.G9(RUF/TEN) IC54.G9(RUF/TEN) IC55.G9(RUF/TEN) IC56.G9(RUF/TEN) IC57.G9(RUF/TEN) IC58.G9(RUF/TEN) R454.1
PR_DDR4_WE_B: IC51.H2(~{WE}/A14) IC52.H2(~{WE}/A14) IC53.H2(~{WE}/A14) IC54.H2(~{WE}/A14) IC55.H2(~{WE}/A14) IC56.H2(~{WE}/A14) IC57.H2(~{WE}/A14) IC58.H2(~{WE}/A14) R483.1
PR_DDR4_ZQ_0: IC51.B9(ZQ) IC52.B9(ZQ) IC53.B9(ZQ) IC54.B9(ZQ) IC55.B9(ZQ) IC56.B9(ZQ) IC57.B9(ZQ) IC58.B9(ZQ) R444.2 R445.2 R446.2 R447.2 R457.2 R458.2 R460.2 R461.2
PR_DDR_RST_B: R453.2
PU_I2C1_SCL: IC59.6(SCL)
PU_I2C1_SDA: IC59.5(SDA)
NetC724_1: C724.1 R442.2 R443.2
NetC741_1: C741.1 R455.2 R456.2
NetIC30_AD24: IC30.AD24(D1_MAPAR_ERR#) R450.1 R451.1
NetIC30_V25: IC30.V25(D1_MDIC0) R449.2
NetIC30_Y25: IC30.Y25(D1_MDIC1) R448.2
NetIC59_7: IC59.7(WP) R459.2

Not connected (* = marked no-connect by the designer): IC30 AA22(D1_MCS3#) AB20(D1_MCS2#)* AC25(D1_MA00) AE23(D1_MBA2) D1(D1_TPA) E23(D1_MDM2) E25(D1_MDQS2) G23(D1_MDM4) H19(D1_MVREF) L21(D1_MDM1) L25(D1_MDM0) M25(D1_MDQS0#) Y21(D1_MWE); IC51 A3(NF/TDQS_C)* N7(A17/NC)*; IC52 A3(NF/TDQS_C)* N7(A17/NC)*; IC53 A3(NF/TDQS_C)* N7(A17/NC)*; IC54 A3(NF/TDQS_C)* N7(A17/NC)*; IC55 A3(NF/TDQS_C)* N7(A17/NC)*; IC56 A3(NF/TDQS_C)* N7(A17/NC)*; IC57 A3(NF/TDQS_C)* N7(A17/NC)*; IC58 A3(NF/TDQS_C)* N7(A17/NC)*; R452 2

## Notes on the sheet
- Title
- Size:
- Date:
- File:
- D
- Number:
- Time:
- Revision:
- Sheet
- of
- (in symbol LS1043ASN8QQB, part A) DDR; 1 OF 16

## Library data of the parts
C716-C723 C733-C740 = CMP-2008-04556-2: CAP CER 1UF 10V X5R 0402; Manufacturer Part Number: GRM155R61A105KE15D; Manufacturer: Murata; Material: Ceramic; Tolerance: 10%; Temperature Coefficient: 15%; Octopart: https://octopart.com/grm155r61a105ke15d-murata-197442; Lead Free: Yes; ComponentLink2Description: Datasheet; Temperature: -55°C to +85°C; Temperature Range High: +85°C; Height: 0.55mm; Capacitance: 1uF; Ipc Land Pattern Name: CAPC10050X50; ComponentLink2URL: https://search.murata.co.jp/Ceramy/image/img/A01X/G101/ENG/GRM155R61A105KE15-01A.pdf; Temperature Range Low: -55°C; Device Class L2: Capacitors; Voltage Rating: 10V; RoHS: TRUE; Device Class L1: Passive Components; Device Class L3: Ceramic Capacitors; Temperature Characteristic: X5R; Mouser Description: 0402 1 uF 10 V ±10% Tolerance X5R Surface Mount Multilayer Ceramic Capacitor; Automotive: No; Package: GRM15-0.1; Digikey Description: CAP CER 1UF 10V X5R 0402; Value: 1uF; Category: Cap
C724 C727 C728 C731 C732 C741 C745 C746 C749 C750 = CMP-2008-02796-1: Manufacturer: AVX Interconnect / Elco; Part Number: 0402YC103JAT2A
C725 C726 C729 C730 C742-C744 C747 C748 C751-C758 C761-C768 C771-C778 C781-C788 C791-C804 C807-C814 C817-C830 C833-C840 C843-C846 = CMP-2100-03641-2: CAP CER 0.1UF 16V X7R 0402; Manufacturer Part Number: GRM155R71C104KA88D; Manufacturer: Murata; Standoff Height: 0mm; Tolerance: 10%; Voltage Rating: 16Vdc; Material: Ceramic; Capacitance: 0.10μF; Value: 0.10μF; RoHS: TRUE; Temperature Characteristic: X7R; Octopart: https://octopart.com/grm155r71c104ka88d-murata-196880; Digikey Description: CAP CER 0.1UF 16V X7R 0402; Device Class L3: Ceramic Capacitors; Height: 0.55mm; ComponentLink2Description: Datasheet; Temperature Range Low: -55°C; Ipc Land Pattern Name: CAPC10050X219; ComponentLink2URL: https://search.murata.co.jp/Ceramy/image/img/A01X/G101/ENG/GRM155R71H471KA01-01A.pdf; Device Class L1: Passive Components; Lead Free: yes; Category: Cap; Package: GRM15; Temperature: -55°C to +125°C; Device Class L2: Capacitors; Temperature Range High: +125°C; Mouser Description: 0402 0.1 uF 16V ±10 % Tolerance X7R SMT Multilayer Ceramic Capacitor
C759 C760 C769 C770 C779 C780 C789 C790 C805 C806 C815 C816 C831 C832 C841 C842 C847 = CMP-2007-03453-2: Chip Multilayer Ceramic Capacitors for General Purpose, 0805, 10uF, X5R, 15%, 10%, 16V; Radiation Hardening: No; Thickness: 0.053inch; Voltage Rating (DC): 16V; Lead Free: Lead Free; Package Quantity: 1; Width: 1.25mm; Case Code (Imperial): 0805; Depth: 1.25mm; Packaging: Tape and Reel; Dielectric: X5R; Max Operating Temperature: 85°C; Tolerance: 10%; Voltage Rating: 16V; Voltage: 16V; Capacitance: 10uF; Height: 1.25mm; Case Code (Metric): 2012; Material: Ceramic; Mount: Surface Mount; Case/Package: 0805; REACH SVHC: No SVHC; Length: 2mm; Min Operating Temperature: -55°C; Termination: SMD/SMT
C848 = CMP-2008-04549-2: Chip Multilayer Ceramic Capacitors for General Purpose, 0402, 4.7uF, X5R, 15%, 20%, 6.3V; Height: 0.5mm; Weight: 0.000212oz; Length: 1mm; Case Code (Metric): 1005; Packaging: Tape and Reel; Termination: SMD/SMT; Dielectric: X5R; Depth: 0.5mm; Case Code (Imperial): 0402; Min Operating Temperature: -55°C; Case/Package: 0402; Voltage: 6.3V; Width: 0.02inch; Capacitance: 4.7uF; Lead Free: Lead Free; Thickness: 0.022inch; Contact Plating: Tin; REACH SVHC: No SVHC; Package Quantity: 10000; Tolerance: 20%; Voltage Rating (DC): 6.3V; Voltage Rating: 6.3V; Mount: Surface Mount; Max Operating Temperature: 85°C
IC30 = LS1043ASN8QQB: Integrated Circuit; Manufacturer_Name: NXP; Datasheet Link: http://www.nxp.com/secured/assets/documents/en/data-sheet/LS1088A.pdf; Height: 2.61mm; Manufacturer_Part_Number: LS1043ASN8QQB; Mouser Part Number: 771-LS1043ASN8QQB; Mouser Price/Stock: https://www.mouser.co.uk/ProductDetail/NXP-Semiconductors/LS1043ASN8QQB/?qs=AQlKX63v8RsTATOTx7X0Jg%3D%3D
IC51-IC58 = MT40A512M8SA-062E_F_TR: Integrated Circuit; Manufacturer_Name: Micron; Manufacturer_Part_Number: MT40A512M8SA-062E:F TR; Datasheet Link: https://componentsearchengine.com/Datasheets/1/MT40A512M8SA-062E_F TR.pdf; Height: 1.2mm; Mouser Part Number: 340-402508-REEL; Mouser Price/Stock: https://www.mouser.co.uk/ProductDetail/Micron/MT40A512M8SA-062EF-TR?qs=B6kkDfuK7%2FBF%2FgRBWVz2BQ%3D%3D
IC59 = AT24C04C-SSHM-T: Integrated Circuit; Manufacturer_Name: Microchip; Datasheet Link: https://datasheet.lcsc.com/szlcsc/Microchip-Tech-AT24C04C-SSHM-T_C6205.pdf; Height: 1.75mm; Manufacturer_Part_Number: AT24C04C-SSHM-T; Mouser Part Number: 556-AT24C04C-SSHM-T; Mouser Price/Stock: https://www.mouser.co.uk/ProductDetail/Microchip-Technology-Atmel/AT24C04C-SSHM-T?qs=rNaVQffb%252BtcPg4SMgvVriA%3D%3D; Arrow Part Number: AT24C04C-SSHM-T; Arrow Price/Stock: https://www.arrow.com/en/products/at24c04c-sshm-t/microchip-technology
R442 R443 R455 R456 = CMP-2002-00305-1: Part Number: CRCW040236R0FKED; Manufacturer: Vishay Dale
R444-R447 R457 R458 R460 R461 = CMP-2002-08397-1: Manufacturer: Vishay Dale; Part Number: CRCW0402240RFKED
R448 R449 = CMP-2002-08231-1: Part Number: CRCW0402162RFKED; Manufacturer: Vishay Dale
R450 = CMP-2002-00051-3: RES Thick Film, 4.7kΩ, 1%, 0.063W, 100ppm/°C, 0402; Voltage Rating (DC): 50V; Power Rating: 63mW; Resistance: 4.7kR; Termination: SMD/SMT; Military Standard: Not; Length: 1mm; Radiation Hardening: No; Max Operating Temperature: 155°C; Min Operating Temperature: -55°C; Package Quantity: 10; Width: 0.5mm; Case Code (Imperial): 0402; Number of Terminations: 2; Max Power Dissipation: 63mW; Tolerance: 1%; Features: Automotive AEC-Q200; Composition: Thick Film; Depth: 0.5mm; Mount: Surface Mount; Weight: 2.3E-05oz; Lead Free: Lead Free; Case/Package: 0402; Height: 0.35mm; Packaging: Tape and Reel; Temperature Coefficient: 100ppm/°C; Case Code (Metric): 1005; Voltage Rating: 50V; Contact Plating: Tin
R451 R452 = CMP-2002-08122-2: RES Thick Film, 0Ω, 0.063W, 0402; Tolerance: 5%; Max Power Dissipation: 63mW; Voltage Rating: 50V; Temperature Coefficient: 100ppm/°C; Resistance: 0mR; Contact Plating: Tin; Height: 0.35mm; Radiation Hardening: No; Features: Automotive AEC-Q200; Composition: Thick Film; Width: 0.5mm; Weight: 2.3E-05oz; Termination: SMD/SMT; Packaging: Tape and Reel; Mount: Surface Mount; Case Code (Metric): 1005; Military Standard: Not; Min Operating Temperature: -55°C; Number of Terminations: 2; Package Quantity: 1; Case Code (Imperial): 0402; Depth: 0.5mm; Max Operating Temperature: 155°C; Case/Package: 0402; Power Rating: 63mW; Lead Free: Lead Free; Voltage Rating (DC): 50V; Length: 1mm
R453 R454 R459 = CMP-2002-01154-4: Chip Resistor, 4.7 KOhm, +/- 1%, 0.1 W, -55 to 155 degC, 0402 (1005 Metric), RoHS, Tape and Reel; PartNumber: ERJ-2RKF4701X; Voltage Rating: 50 V; Case\/Package: 0402; Power Rating: 100 mW; Height: 0.35 mm; Mounting Technology: Surface Mount; REACH SVHC: Yes; Resistance: 4.7 KOhm; Max Operating Temperature: 155 degC; ComponentLink1Description: Manufacturer URL; ComponentLink2Description: Datasheet; Pins: 2; PackageReference: 0402; Tolerance: 1%; Case Code (Imperial): 0402; Length: 1 mm; PackageDescription: 2-Pin Surface Mount Device, Body 1 x 0.5 mm; RoHSCompliant: true; Package Quantity: 1; Radiation Hardening: No; DatasheetVersion: 04/2015; Width: 0.5 mm; Case Code (Metric): 1005; Mount: Surface Mount; ComponentLink1URL: http://www.panasonic.com/; Min Operating Temperature: -55 degC; Packaging: Cut Tape; ComponentLink2URL: http://industrial.panasonic.com/cdbs/www-data/pdf/RDA0000/AOA0000C86.pdf
R462-R490 = CMP-2002-00915-1: Part Number: ERJ2RKF39R0X; Manufacturer: Panasonic